# EAGLE design display (EAGLE 7.4.0)
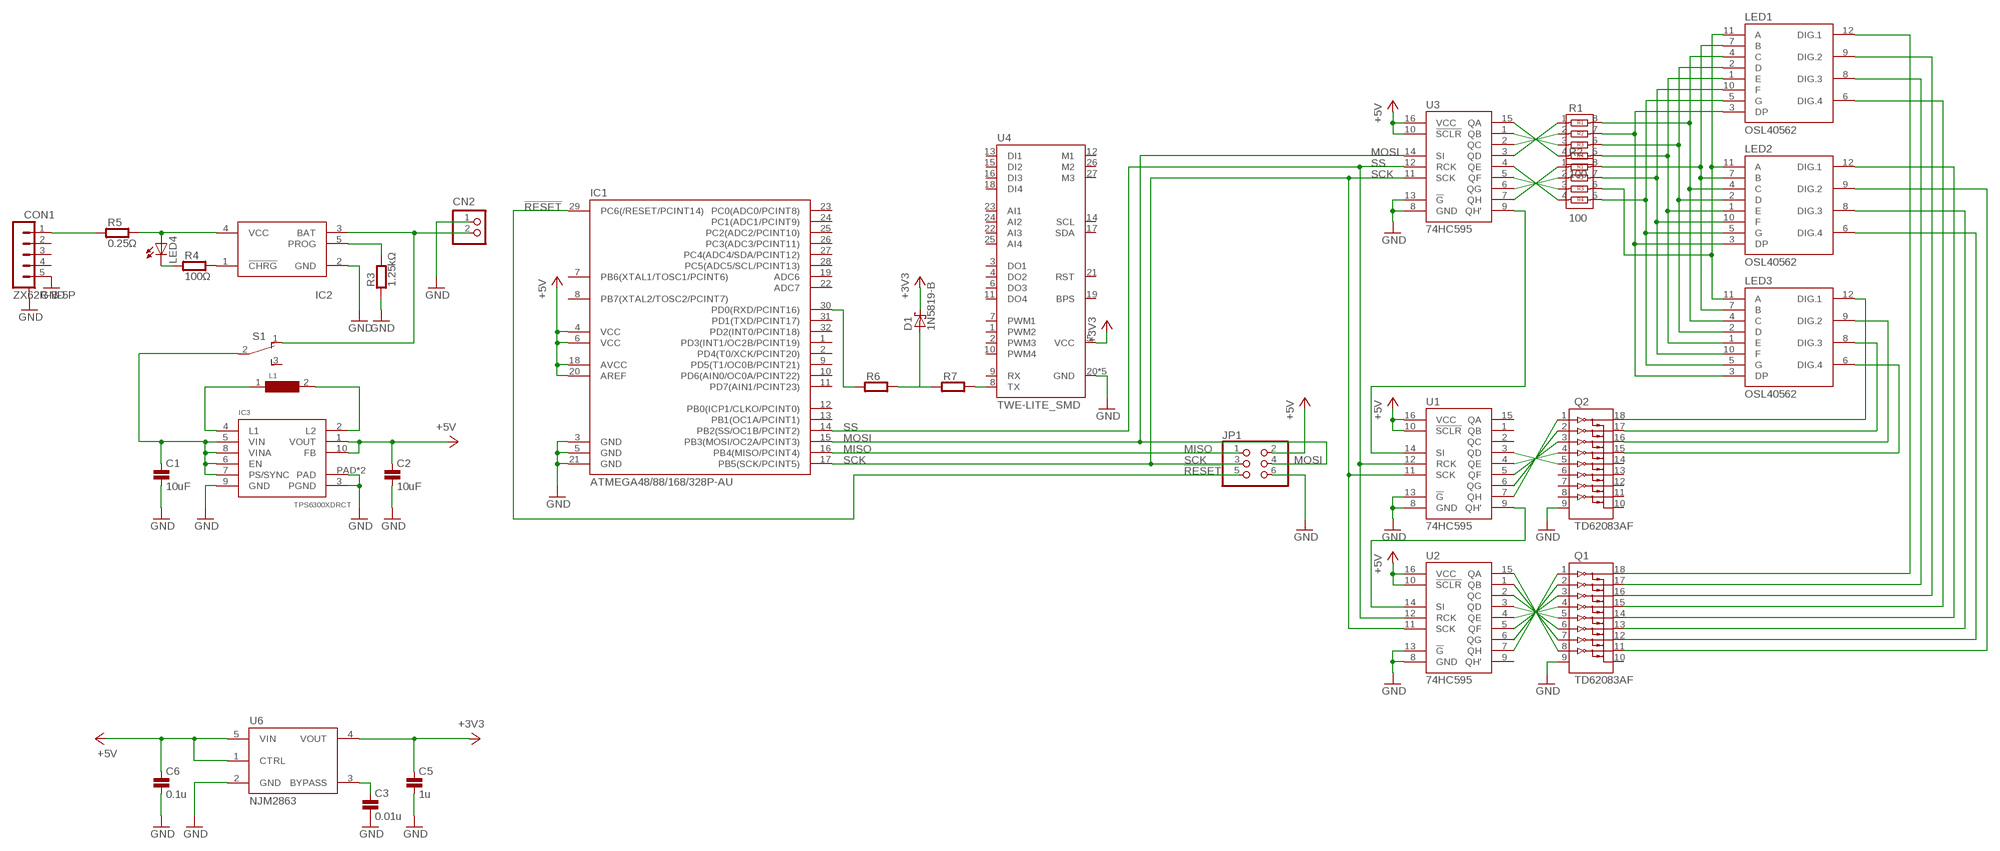
[diagram p0: schematic, sheet 1]

## Parts
C1  10uF  C0603  [0603@1]
C2  10uF  C0603  [0603@1]
C3  0.01u  C0603  [0603@1]
C5  1u  C0603  [0603@1]
C6  0.1u  C0603  [0603@1]
CN2  S2B-PH-K-S  [S2B-PH-K-S]
CON1  ZX62R-B-5P  [MICRO-B]
D1  1N5819-B  [DO41-7.6]
IC1  ATMEGA48/88/168/328P-AU  [TQFP32]
IC2  LTC4054  [TSOT23-5]
IC3  TPS6300XDRCT  [S-PVSON-N10]
JP1  PINHD-2X3  [2X03]
L1  VLF4012ST  [VLF4012ST]
LED1  OSL40562  [7SEG_4DIG]
LED2  OSL40562  [7SEG_4DIG]
LED3  OSL40562  [7SEG_4DIG]
LED4  LEDSML0603  [SML0603]
Q1  TD62083AF  [SOP18]
Q2  TD62083AF  [SOP18]
R1  100  BCN164AB  [BCN164AB]
R2  100  BCN164AB  [BCN164AB]
R3  1.25kΩ  R0603  [0603]
R4  100Ω  R0603  [0603]
R5  0.25Ω  R0603  [0603]
R6  R0204/5  [0204/5]
R7  R0204/5  [0204/5]
S1  SS-12D00  [SS-12D00]
U1  74HC595  [SOP16]
U2  74HC595  [SOP16]
U3  74HC595  [SOP16]
U4  TWE-LITE_SMD  [LITE]
U6  NJM2863  [SOT23_5PIN]

## Nets
!RESET!: IC1.29(PC6(/RESET/PCINT14)) JP1.5
+3V2: C1.1 IC3.5(VIN) IC3.6(EN) IC3.7(PS/SYNC) IC3.8(VINA) S1.2(P)
+3V3: C5.1 D1.C U4.5(VCC) U6.4(VOUT)
+5V: C2.1 C6.1 IC1.4(VCC) IC1.6(VCC) IC1.18(AVCC) IC1.20(AREF) IC3.1(VOUT) IC3.10(FB) JP1.2 U1.10(!SCLR!) U1.16(VCC) U2.10(!SCLR!) U2.16(VCC) U3.10(!SCLR!) U3.16(VCC) U6.1(CTRL) U6.5(VIN)
GND: C1.2 C2.2 C3.2 C5.2 C6.2 CN2.1 CON1.5(5.GND) CON1.CASE@1 CON1.CASE@2 CON1.CASE@3 CON1.CASE@4 IC1.3(GND) IC1.5(GND) IC1.21(GND) IC2.2(GND) IC3.3(PGND) IC3.9(GND) IC3.PAD IC3.PAD@1(PAD) JP1.6 Q1.9(GND) Q2.9(GND) R3.1 U1.8(GND) U1.13(!G!) U2.8(GND) U2.13(!G!) U3.8(GND) U3.13(!G!) U4.20(GND) U4.28(GND) U4.30(GND) U4.31(GND) U4.32(GND) U6.2(GND)
MISO: IC1.16(PB4(MISO/PCINT4)) JP1.1
MOSI: IC1.15(PB3(MOSI/OC2A/PCINT3)) JP1.4 U3.14(SI)
N$1: LED1.11(A) LED2.11(A) LED3.11(A) R2.6
N$2: LED1.7(B) LED2.7(B) LED3.7(B) R2.8
N$3: LED1.4(C) LED2.4(C) LED3.4(C) R1.8
N$4: LED1.2(D) LED2.2(D) LED3.2(D) R1.6
N$5: LED1.1(E) LED2.1(E) LED3.1(E) R1.5
N$6: LED1.10(F) LED2.10(F) LED3.10(F) R2.7
N$7: LED1.5(G) LED2.5(G) LED3.5(G) R2.5
N$8: LED1.3(DP) LED2.3(DP) LED3.3(DP) R1.7
N$9: CN2.2 IC2.3(BAT) S1.1(O)
N$10: C3.1 U6.3(BYPASS)
N$12: Q2.5(I5) U1.3(QD)
N$13: Q2.4(I4) U1.4(QE)
N$14: Q2.3(I3) U1.5(QF)
N$15: Q2.2(I2) U1.6(QG)
N$16: Q2.1(I1) U1.7(QH)
N$17: LED2.9(DIG.2) Q1.11(O8)
N$18: LED2.8(DIG.3) Q1.13(O6)
N$19: LED2.6(DIG.4) Q1.12(O7)
N$20: LED2.12(DIG.1) Q1.14(O5)
N$21: LED1.6(DIG.4) Q1.15(O4)
N$22: LED1.12(DIG.1) Q1.18(O1)
N$23: LED1.8(DIG.3) Q1.17(O2)
N$24: LED1.9(DIG.2) Q1.16(O3)
N$25: LED3.12(DIG.1) Q2.18(O1)
N$26: LED3.9(DIG.2) Q2.16(O3)
N$27: LED3.8(DIG.3) Q2.17(O2)
N$28: LED3.6(DIG.4) Q2.15(O4)
N$29: Q1.8(I8) U2.15(QA)
N$30: Q1.7(I7) U2.1(QB)
N$31: Q1.6(I6) U2.2(QC)
N$32: Q1.5(I5) U2.3(QD)
N$33: Q1.4(I4) U2.4(QE)
N$34: Q1.3(I3) U2.5(QF)
N$35: Q1.2(I2) U2.6(QG)
N$36: Q1.1(I1) U2.7(QH)
N$37: U1.9(QH') U2.14(SI)
N$38: R1.4 U3.15(QA)
N$39: R1.3 U3.1(QB)
N$40: R1.2 U3.2(QC)
N$41: R1.1 U3.3(QD)
N$42: R2.4 U3.4(QE)
N$43: R2.3 U3.5(QF)
N$44: R2.2 U3.6(QG)
N$45: R2.1 U3.7(QH)
N$46: U1.14(SI) U3.9(QH')
N$47: IC1.30(PD0(RXD/PCINT16)) R6.1
N$48: IC2.5(PROG) R3.2
N$49: IC2.4(VCC) LED4.A R5.2
N$50: IC2.1(!CHRG!) R4.2
N$51: LED4.C R4.1
N$52: IC3.4(L1) L1.1
N$53: IC3.2(L2) L1.2
N$57: D1.A R6.2 R7.1
N$58: R7.2 U4.8(TX)
N$59: CON1.1(1.VBUS) R5.1
SCK: IC1.17(PB5(SCK/PCINT5)) JP1.3 U1.11(SCK) U2.11(SCK) U3.11(SCK)
SS: IC1.14(PB2(SS/OC1B/PCINT2)) U1.12(RCK) U2.12(RCK) U3.12(RCK)
Unconnected: CON1.2(2.D-) CON1.3(3.D+) CON1.4(4.ID) IC1.1(PD3(INT1/OC2B/PCINT19)) IC1.2(PD4(T0/XCK/PCINT20)) IC1.7(PB6(XTAL1/TOSC1/PCINT6)) IC1.8(PB7(XTAL2/TOSC2/PCINT7)) IC1.9(PD5(T1/OC0B/PCINT21)) IC1.10(PD6(AIN0/OC0A/PCINT22)) IC1.11(PD7(AIN1/PCINT23)) IC1.12(PB0(ICP1/CLKO/PCINT0)) IC1.13(PB1(OC1A/PCINT1)) IC1.19(ADC6) IC1.22(ADC7) IC1.23(PC0(ADC0/PCINT8)) IC1.24(PC1(ADC1/PCINT9)) IC1.25(PC2(ADC2/PCINT10)) IC1.26(PC3(ADC3/PCINT11)) IC1.27(PC4(ADC4/SDA/PCINT12)) IC1.28(PC5(ADC5/SCL/PCINT13)) IC1.31(PD1(TXD/PCINT17)) IC1.32(PD2(INT0/PCINT18)) Q1.10(COMMON) Q2.6(I6) Q2.7(I7) Q2.8(I8) Q2.10(COMMON) Q2.11(O8) Q2.12(O7) Q2.13(O6) Q2.14(O5) S1.3(S) U1.1(QB) U1.2(QC) U1.15(QA) U2.9(QH') U4.1(PWM2) U4.2(PWM3) U4.3(DO1) U4.4(DO2) U4.6(DO3) U4.7(PWM1) U4.9(RX) U4.10(PWM4) U4.11(DO4) U4.12(M1) U4.13(DI1) U4.14(SCL) U4.15(DI2) U4.16(DI3) U4.17(SDA) U4.18(DI4) U4.19(BPS) U4.21(RST) U4.22(AI3) U4.23(AI1) U4.24(AI2) U4.25(AI4) U4.26(M2) U4.27(M3)

## Library data of the parts
C1-C3 C5 C6 = untitled:C: CAPACITOR
CN2 = jst-ph:S2B-PH-*: Wire-to-Board 2.0mm pitch side mount connector Source: http://www.jst-mfg.com/product/pdf/jpn/PH.pdf http://www.jst-mfg.com/product/detail.php?series=199
CON1 = untitled:ZX62R-B-5P
D1 = diode:1N581*: 1.0A SCHOTTKY BARRIER RECTIFIER Source: http://www.diodes.com/datasheets/ds23001.pdf
IC1 = ATmega328P:ATMEGA48/88/168/328P
IC2 = untitled:LTC4054
IC3 = untitled:TPS6300XDRCT
JP1 = pinhead:PINHD-2X3: PIN HEADER
L1 = untitled:VLF4012ST
LED1-LED3 = untitled:OSL40562
LED4 = led:LED: LED OSRAM: - CHIPLED LG R971, LG N971, LY N971, LG Q971, LY Q971, LO R971, LY R971 LH N974, LH R974 LS Q976, LO Q976, LY Q976 LO Q996 - Hyper CHIPLED LW Q18S LB Q993, LB Q99A, LB R99A - SideLED LS A670, LO A670, LY A670, LG A670, LP A670 LB A673, LV A673, LT A673, LW A673 LH A674 LY A675 LS A676, LA A676, LO A676, LY A676, LW A676 LS A679, LY A679, LG A679 - Hyper Micro SIDELED® LS Y876, LA Y876, LO Y876, LY Y876 LT Y87S - SmartLED LW L88C, LW L88S LB L89C, LB L89S, LG L890 LS L89K, LO L89K, LY L89K LS L896, LA L896, LO L896, LY L896 - TOPLED LS T670, LO T670, LY T670, LG T670, LP T670 LSG T670, LSP T670, LSY T670, LOP T670, LYG T670 LG T671, LOG T671, LSG T671 LB T673, LV T673, LT T673, LW T673 LH T674 LS T676, LA T676, LO T676, LY T676, LB T676, LH T676, LSB T676, LW T676 LB T67C, LV T67C, LT T67C, LS T67K, LO T67K, LY T67K, LW E67C LS E67B, LA E67B, LO E67B, LY E67B, LB E67C, LV E67C, LT E67C LW T67C LS T679, LY T679, LG T679 LS T770, LO T770, LY T770, LG T770, LP T770 LB T773, LV T773, LT T773, LW T773 LH T774 LS E675, LA E675, LY E675, LS T675 LS T776, LA T776, LO T776, LY T776, LB T776 LHGB T686 LT T68C, LB T68C - Hyper Mini TOPLED® LB M676 - Mini TOPLED Santana® LG M470 LS M47K, LO M47K, LY M47K Source: http://www.osram.convergy.de LUXEON: - LUMILED® LXK2-PW12-R00, LXK2-PW12-S00, LXK2-PW14-U00, LXK2-PW14-V00 LXK2-PM12-R00, LXK2-PM12-S00, LXK2-PM14-U00 LXK2-PE12-Q00, LXK2-PE12-R00, LXK2-PE12-S00, LXK2-PE14-T00, LXK2-PE14-U00 LXK2-PB12-K00, LXK2-PB12-L00, LXK2-PB12-M00, LXK2-PB14-N00, LXK2-PB14-P00, LXK2-PB14-Q00 LXK2-PR12-L00, LXK2-PR12-M00, LXK2-PR14-Q00, LXK2-PR14-R00 LXK2-PD12-Q00, LXK2-PD12-R00, LXK2-PD12-S00 LXK2-PH12-R00, LXK2-PH12-S00 LXK2-PL12-P00, LXK2-PL12-Q00, LXK2-PL12-R00 Source: www.luxeon.com KINGBRIGHT: KA-3528ASYC Source: www.kingbright.com
Q1 Q2 = untitled:TD62083A
R1 R2 = untitled:BCN164AB
R3-R7 = untitled:R: RESISTOR
S1 = switch-slide:SS-12D00: SLIDE SWITCH
U1-U3 = untitled:74HC595
U4 = untitled:TWE-LITE
U6 = untitled:NJM2863

## Board
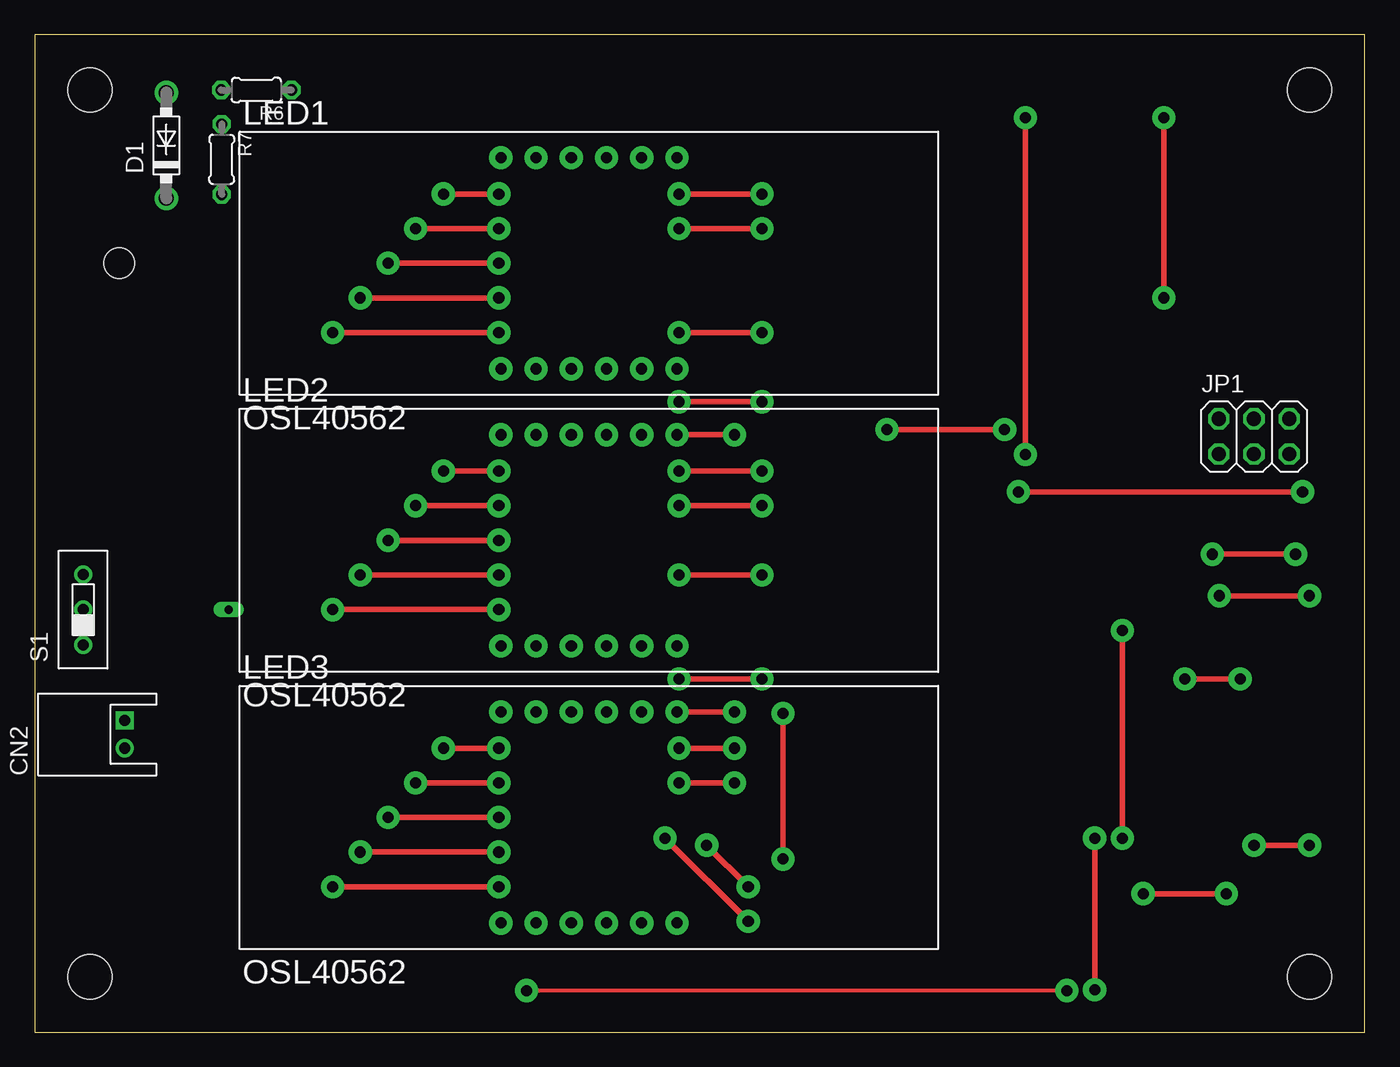
[diagram p1: board, top side]
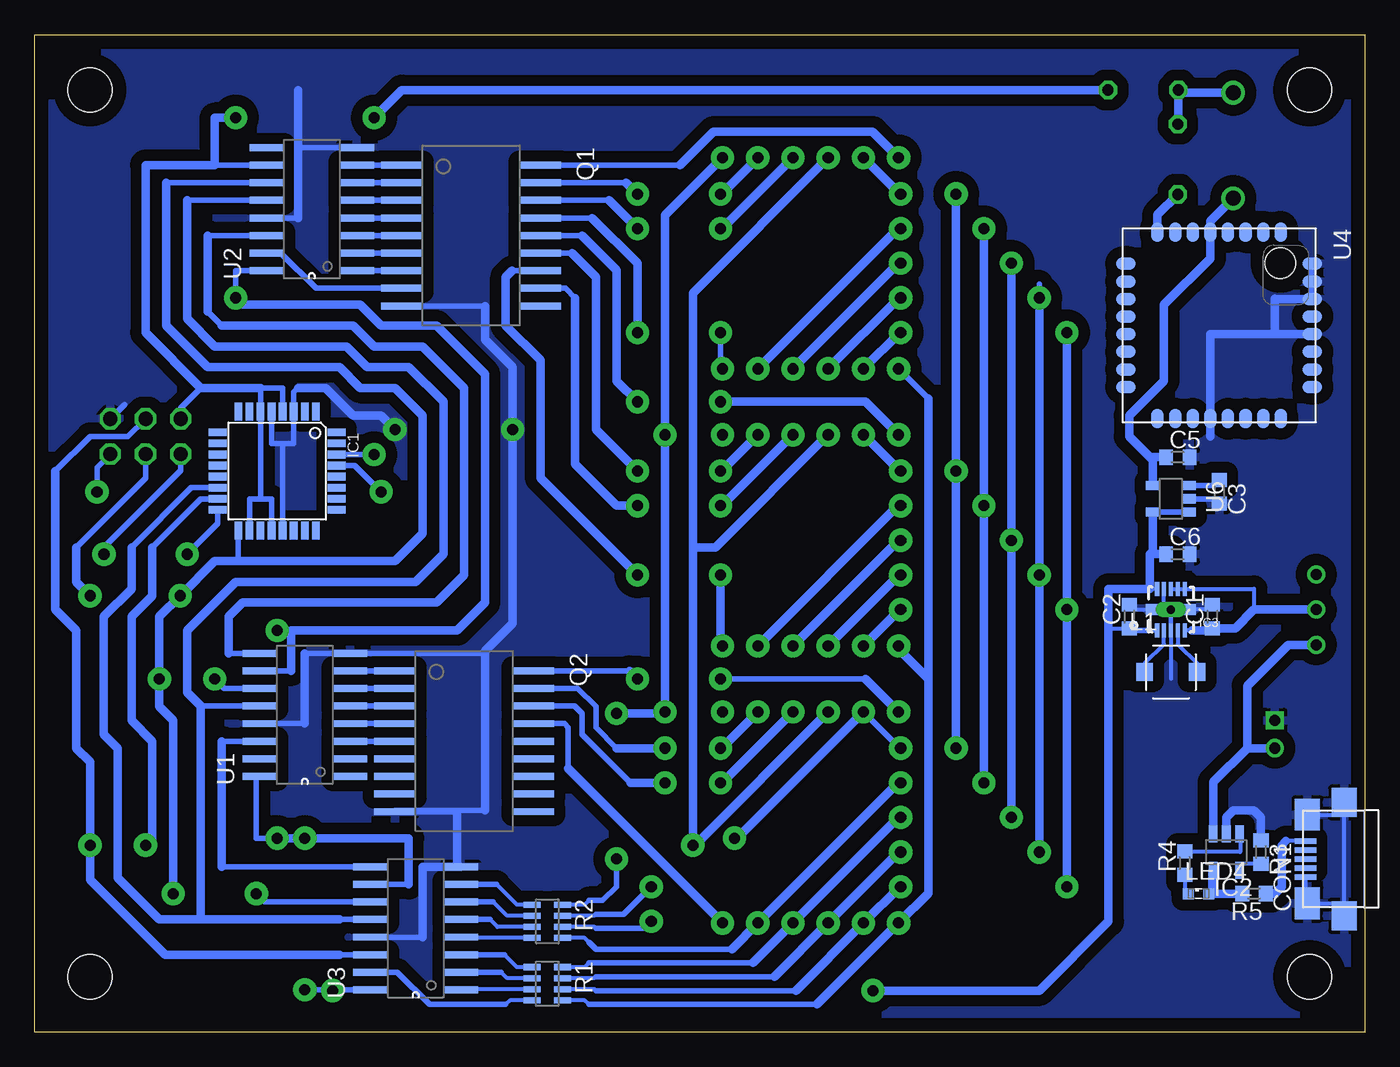
[diagram p2: board, bottom side, seen from below]

Size 96 x 72 mm. Coordinates in mm from the lower left corner, seen from the top.
Outline: 0,0 96,0 96,72 0,72 0,0
Copper layers (1*16): Top 0.035mm / dielectric 1.5mm / Bottom 0.035mm
Design rules "default *": minimum track width 10mil, minimum drill 24mil, track to track 8mil, track to pad 8mil, pad to pad 8mil, via to via 8mil, smd to smd 8mil, copper to edge 40mil, drill to drill 8mil, minimum pad ring 10mil, minimum via ring 8mil, stop-mask expansion 4mil, vias tented up to drill 0mil, thermal gap 10mil
Holes 2.2 mm at 6.1,55.5
Holes 3.2 mm at 4,68 92,68 4,4 92,4

### Footprints (pad centres in the part's own frame; a part is rotated, then mirrored left to right if it is on the bottom)
0603@1 = smd 1 x 1.1: 1 -0.85,0; 2 0.85,0
S2B-PH-K-S = drill 0.8 square: 1 1,0 | drill 0.8: 2 -1,0
MICRO-B = smd 0.4 x 1.55: 1 1.3,2.775; 2 0.65,2.775; 3 0,2.775; 4 -0.65,2.775; 5 -1.3,2.775 | smd 2.3 x 1.8: CASE@1 -3.2,2.65; CASE@2 3.2,2.65 | smd 2.1 x 1.8: CASE@3 -4.1,0; CASE@4 4.075,0
DO41-7.6 = drill 1.1 pad 1.7: A 3.81,0; C -3.81,0
TQFP32 = smd 1.27 x 0.559: 1 -4.293,2.8; 2 -4.293,2; 3 -4.293,1.2; 4 -4.293,0.4; 5 -4.293,-0.4; 6 -4.293,-1.2; 7 -4.293,-2; 8 -4.293,-2.8; 17 4.293,-2.8; 18 4.293,-2; 19 4.293,-1.2; 20 4.293,-0.4; 21 4.293,0.4; 22 4.293,1.2; 23 4.293,2; 24 4.293,2.8 | smd 0.559 x 1.27: 9 -2.8,-4.293; 10 -2,-4.293; 11 -1.2,-4.293; 12 -0.4,-4.293; 13 0.4,-4.293; 14 1.2,-4.293; 15 2,-4.293; 16 2.8,-4.293; 25 2.8,4.293; 26 2,4.293; 27 1.2,4.293; 28 0.4,4.293; 29 -0.4,4.293; 30 -1.2,4.293; 31 -2,4.293; 32 -2.8,4.293
TSOT23-5 = smd 0.62 x 1.22: 1 -0.95,-1.31; 2 0,-1.31; 3 0.95,-1.31; 4 0.95,1.31; 5 -0.95,1.31
S-PVSON-N10 = smd 0.3 x 1: 1 -1,-1.5; 2 -0.5,-1.5; 3 0,-1.5; 4 0.5,-1.5; 5 1,-1.5; 6 1,1.5; 7 0.5,1.5; 8 0,1.5; 9 -0.5,1.5; 10 -1,1.5 | smd 3.6 x 0.8: PAD 0,0 | drill 0.6 long: PAD@1 0,0
2X03 = drill 1.016 octagon: 1 -2.54,-1.27; 2 -2.54,1.27; 3 0,-1.27; 4 0,1.27; 5 2.54,-1.27; 6 2.54,1.27
VLF4012ST = smd 1.2 x 1.3: 1 1.9,0; 2 -1.9,0
7SEG_4DIG = drill 0.8 pad 1.676: 1 -6.35,-7.62; 2 -3.81,-7.62; 3 -1.27,-7.62; 4 1.27,-7.62; 5 3.81,-7.62; 6 6.35,-7.62; 7 6.35,7.62; 8 3.81,7.62; 9 1.27,7.62; 10 -1.27,7.62; 11 -3.81,7.62; 12 -6.35,7.62
SML0603 = smd 0.8 x 0.8: A 0.75,0; C -0.75,0
SOP18 = smd 0.5 x 3: 1 -5.08,-5; 2 -3.81,-5; 3 -2.54,-5; 4 -1.27,-5; 5 0,-5; 6 1.27,-5; 7 2.54,-5; 8 3.81,-5; 9 5.08,-5; 10 5.08,5; 11 3.81,5; 12 2.54,5; 13 1.27,5; 14 0,5; 15 -1.27,5; 16 -2.54,5; 17 -3.81,5; 18 -5.08,5
BCN164AB = smd 0.44 x 1.2: 1 -1.2,-1.1; 2 -0.4,-1.1; 3 0.4,-1.1; 4 1.2,-1.1; 5 1.2,1.1; 6 0.4,1.1; 7 -0.4,1.1; 8 -1.2,1.1
0603 = smd 1 x 1.1: 1 -0.85,0; 2 0.85,0
0204/5 = drill 0.813 octagon: 1 -2.54,0; 2 2.54,0
SS-12D00 = drill 0.8: 1 -2.54,0; 2 0,0; 3 2.54,0
SOP16 = smd 0.5 x 2.5: 1 -4.445,-3.25; 2 -3.175,-3.25; 3 -1.905,-3.25; 4 -0.635,-3.25; 5 0.635,-3.25; 6 1.905,-3.25; 7 3.175,-3.25; 8 4.445,-3.25; 9 4.445,3.25; 10 3.175,3.25; 11 1.905,3.25; 12 0.635,3.25; 13 -0.635,3.25; 14 -1.905,3.25; 15 -3.175,3.25; 16 -4.445,3.25
LITE = smd 1.4 x 0.9: 1 0.25,11.43; 2 0.25,10.16; 3 0.25,8.89; 4 0.25,7.62; 5 0.25,6.35; 6 0.25,5.08; 7 0.25,3.81; 8 0.25,2.54; 17 13.72,2.54; 18 13.72,3.81; 19 13.72,5.08; 20 13.72,6.35; 21 13.72,7.62; 22 13.72,8.89; 23 13.72,10.16; 24 13.72,11.43 | smd 0.9 x 1.4: 9 2.54,0.25; 10 3.81,0.25; 11 5.08,0.25; 12 6.35,0.25; 13 7.62,0.25; 14 8.89,0.25; 15 10.16,0.25; 16 11.43,0.25; 25 11.43,13.72; 26 10.16,13.72; 27 8.89,13.72; 28 7.62,13.72; 29 6.35,13.72; 30 5.08,13.72; 31 3.81,13.72; 32 2.54,13.72
SOT23_5PIN = smd 0.66 x 1: 1 0.95,1.3; 2 0,1.3; 3 -0.95,1.3; 4 -0.95,-1.3; 5 0.95,-1.3

### Placement (x,y rotation side)
C1  11,30 90 bottom
C2  17,30 90 bottom
C3  10.5,39 270 bottom
C5  13.5,41.5 0 bottom
C6  13.5,34.5 0 bottom
CN2  6.5,21.5 90 top
CON1  1.5,12.5 90 bottom
D1  9.5,64 90 top
IC1  78.5,40.5 270 bottom
IC2  10,13 180 bottom
IC3  14,30.5 0 bottom
JP1  88,43 0 top
L1  14,26 0 bottom
LED1  40,55.5 0 top
LED2  40,35.5 0 top
LED3  40,15.5 0 top
LED4  12,10 0 bottom
Q1  64.5,57.5 270 bottom
Q2  65,21 270 bottom
R1  59,3.5 270 bottom
R2  59,8 270 bottom
R3  7.5,13 270 bottom
R4  13,12.2 90 bottom
R5  8,10 180 bottom
R6  16,68 180 top
R7  13.5,63 270 top
S1  3.5,30.5 90 top
U1  76.5,22.91 90 bottom
U2  76,59.41 90 bottom
U3  68.5,7.5 90 bottom
U4  17.5,58 270 bottom
U6  14,38.5 270 bottom

### Tracks (layer width: path | path; a pad name or v marks a point on that pad's centre or on a via)
!RESET!  (via drill 0.8 pad 1.68)
  Top 0.406: v71,39 v91.5,39
  Bottom 0.406: IC1.29 72.9,40.9 v71,39 | JP1.5 91.5,40.77 v91.5,39
+3V2
  Bottom 0.305: 12.5,29 IC3.5 | IC3.8 IC3.7 IC3.6 8,32 8,30.5
  Bottom 0.61: S1.2 8,30.5 9.35,29.15 C1.1 11.15,29 12.5,29
+3V3
  Bottom 0.61: D1.C 11.15,58.54 U4.5 11.15,55.85 14.5,52.5 14.5,47 17,44.5 17,43 15.5,41.5 | 15.5,41.5 C5.1 | 15.5,41.5 15.3,41.3 U6.4
+5V  (via drill 0.8 pad 1.68)
  Top 0.305: v74.5,3 v35.5,3
  Top 0.406: v76.5,14 v76.5,3.06 | v78.5,29 v78.5,14 | v81.5,53 v81.5,66
  Bottom 0.305: 17,29 C2.1 18.5,29.15 | 15.5,29 IC3.1 | IC3.10 15.5,32 | 75.5,3.06 74.5,3.06 v74.5,3
  Bottom 0.406: U3.10 69,10.68 | U3.16 75.5,3.06 v76.5,3.06 | U1.16 80,18.46 80,14 v78.5,14 | U1.10 77.5,26.08 | 77.5,29 v78.5,29 | 81,52.5 v81.5,53 81.5,54.96 U2.16 | 83,62.58 U2.10 | IC1.4 78.1,46.5 79.7,46.5 IC1.6 79.7,38.5 | IC1.20 78.9,38.5 79.7,38.5 | 79.7,38.5 80.5,38.5 IC1.18 | 84,46.5 85.46,45.04 JP1.2 | 17,29 15.5,29 | U6.1 U6.5
  Bottom 0.61: 69,10.68 69,14 v76.5,14 v78.5,14 | 77.5,26.08 77.5,29 65.5,29 63.5,31 63.5,47.5 67,51 71,51 72.5,52.5 81,52.5 | v81.5,66 83,66 83,62.58 88,62.58 88,50.5 84,46.5 79.7,46.5 | v35.5,3 23.5,3 18.5,8 18.5,29.15 18.5,32 15.5,32 15.5,34.5 | C6.1 15.3,34.5 | 15.5,34.5 15.3,34.7 | U6.5 15.3,34.5 | 15.3,34.5 15.5,34.5
GND  (via drill 0.8 pad 1.68)
  Top 0.406: v70,43.5 v61.5,43.5
  Bottom 0.305: CON1.CASE@3 1.5,9.3 | 1.5,9.3 CON1.CASE@4 1.5,15.7 CON1.CASE@2 | 1.5,9.3 CON1.CASE@1 4.28,9.3 CON1.5 | IC3.3 IC3.PAD@1 | C2.2 17,30.5 IC3.PAD@1 | IC3.PAD@1 14.5,30.5 IC3.9 | IC3.PAD@1 11,30.5 C1.2 11.35,30.5 IC3.PAD@1 | IC2.2 10,15.5 | IC3.PAD@1 14,25.5
  Bottom 0.406: 68,6.87 U3.13 | U3.8 65.25,12 65.5,12 | 65.5,15.92 Q2.9 70,16 63.5,16 | 63.5,27.35 U1.8 76.5,27.35 | 76.5,22.27 U1.13 | U2.8 77,63.85 | 77,58.77 U2.13 | Q1.9 63.5,52.42 | 78.1,42.5 77.3,42.5 IC1.3 77.3,46.2 77,46.5 | 78.1,42.5 78.9,42.5 IC1.5 | IC1.21 78.1,42.5 | JP1.6 89.5,45.31 | C3.2 10.85,38.5 U6.2
  Bottom 0.61: U3.8 68,11.95 68,6.87 | 65.5,12 65.5,15.92 | 63.5,16 63.5,27.35 63.5,27.5 61.5,29.5 v61.5,43.5 61.5,48 63.5,50 63.5,52.42 | 76.5,27.35 76.5,22.27 | 77,58.77 77,63.85 77,68 | 77,46.5 75,46.5 73,44.5 71,44.5 v70,43.5 | U4.28 6.5,50.38 | 6.5,50.38 11.15,50.38 U4.20 11.15,43 | 6.5,52.92 6.5,50.38 | U4.31 U4.32 U4.30 6.5,52.92 | 6.5,52.92 6.5,52.96 | R3.1 7.5,15.5 8,16 9.5,16 10,15.5 10,14 | 4.15,15.5 CON1.CASE@2
  pour Bottom (isolate 0.813): 0,72 96,72 96,0 0,0
MISO  (via drill 0.8 pad 1.68)
  Top 0.406: v85,34.5 v91,34.5
  Bottom 0.406: IC1.16 82.79,36.71 v85,34.5 | JP1.1 85.46,40.54 91,35 v91,34.5
MOSI  (via drill 0.8 pad 1.68)
  Top 0.406: v92,13.5 v88,13.5
  Bottom 0.406: IC1.15 84,38.5 87.5,35 | JP1.4 89.27,43 92,43 94.5,40.5 | U3.14 74,5.59
  Bottom 0.61: v88,13.5 87.5,14 87.5,21 89,22.5 89,30 87.5,31.5 87.5,35 | 74,5.59 86.59,5.59 92,11 v92,13.5 92,19.5 93,20.5 93,29 94.5,30.5 94.5,40.5
N$1  (via drill 0.8 pad 1.68)
  Top 0.406: v33.5,20.5 v29.5,20.5 | v33.5,40.5 v29.5,40.5 | v33.5,60.5 v29.5,60.5 | v45.5,14 v51.5,8
  Bottom 0.305: 55.5,7.5 55.6,7.6 R2.6
  Bottom 0.406: LED3.11 33.57,20.5 v33.5,20.5 | 33.57,40.5 v33.5,40.5 | 33.57,60.5 v33.5,60.5 | 45.31,14 v45.5,14 | v51.5,8 52,7.5 55.5,7.5
  Bottom 0.61: v29.5,20.5 v29.5,40.5 v29.5,60.5 | LED2.11 33.57,40.5 | LED1.11 33.57,60.5 | LED3.11 45.31,14
N$2  (via drill 0.8 pad 1.68)
  Top 0.406: LED3.7 v50.5,23.12 | LED2.7 v50.5,43.12 | v54,23 v54,12.5
  Bottom 0.305: 56,9.5 56.3,9.2 R2.8
  Bottom 0.406: v50.5,23.12 50.62,23 | v54,12.5 54,10.5 55,9.5 56,9.5
  Bottom 0.61: LED1.7 50.5,58.97 v50.5,43.12 v50.5,23.12 | 50.62,23 v54,23
N$3  (via drill 0.8 pad 1.68)
  Top 0.406: v33.5,15.5 v25.5,15.5 | v33.5,35.5 v25.5,35.5 | v33.5,55.5 v25.5,55.5
  Bottom 0.305: 56,5 56.3,4.7 R1.8
  Bottom 0.406: 33.65,15.5 v33.5,15.5 | 33.65,35.5 v33.5,35.5 | 33.65,55.5 v33.5,55.5 | 44.15,5 56,5
  Bottom 0.61: 33.65,15.5 LED3.4 44.15,5 | v25.5,15.5 v25.5,35.5 v25.5,55.5 | LED2.4 33.65,35.5 | LED1.4 33.65,55.5
N$4  (via drill 0.8 pad 1.68)
  Top 0.406: v33.5,10.5 v21.5,10.5 | v33.5,30.5 v21.5,30.5 | v33.5,50.5 v21.5,50.5
  Bottom 0.305: 55.5,3 55.6,3.1 R1.6
  Bottom 0.406: 33.57,10.5 v33.5,10.5 | 33.57,30.5 v33.5,30.5 | 33.57,50.5 v33.5,50.5 | 41.07,3 55.5,3
  Bottom 0.61: 33.57,10.5 LED3.2 41.07,3 | v21.5,10.5 v21.5,30.5 v21.5,50.5 | LED2.2 33.57,30.5 | LED1.2 33.57,50.5
N$5
  Bottom 0.305: 56,2 56.3,2.3 R1.5
  Bottom 0.406: 33.65,27.65 LED2.1 | LED1.1 31.5,45.73 | 39.53,2 56,2
  Bottom 0.61: 31.5,25.5 31.5,10.03 LED3.1 39.53,2 | 31.5,25.5 33.65,27.65 | 31.5,45.73 31.5,25.5
N$6  (via drill 0.8 pad 1.68)
  Top 0.406: v48.5,13.5 v51.5,10.5
  Bottom 0.305: 55.5,8.5 55.6,8.4 R2.7
  Bottom 0.406: 48.35,13.5 v48.5,13.5 | v51.5,10.5 53.5,8.5 55.5,8.5
  Bottom 0.61: LED1.10 48.5,53.35 48.5,35 | 48.5,35 v48.5,13.5 | LED3.10 48.35,13.5 | LED2.10 46.85,35 48.5,35
N$7  (via drill 0.8 pad 1.68)
  Top 0.406: v33.5,18 v27.5,18 | v33.5,38 v27.5,38 | v33.5,58 v27.5,58
  Bottom 0.305: 56,6.5 56.3,6.8 R2.5
  Bottom 0.406: 33.69,18 v33.5,18 | 33.69,38 v33.5,38 | 33.69,58 v33.5,58 | 45.69,6 55.5,6 56,6.5
  Bottom 0.61: 33.69,18 LED3.5 45.69,6 | v27.5,18 v27.5,38 v27.5,58 | LED2.5 33.69,38 | LED1.5 33.69,58
N$8  (via drill 0.8 pad 1.68)
  Top 0.406: v33.5,13 v23.5,13 | v33.5,33 v23.5,33 | v33.5,53 v23.5,53
  Bottom 0.305: 55.5,4 55.6,3.9 R1.7
  Bottom 0.406: 33.61,13 v33.5,13 | v23.5,53 23.5,54 | 33.61,33 v33.5,33 | 33.61,53 v33.5,53 | 42.61,4 55.5,4
  Bottom 0.61: 33.61,13 LED3.3 42.61,4 | v23.5,13 v23.5,33 v23.5,53 | LED2.3 33.61,33 | LED1.3 33.61,53
N$9
  Bottom 0.61: S1.1 5.54,27.96 8.5,25 8.5,20.5 | 8.5,20.5 CN2.2 | IC2.3 10.95,18.05 8.5,20.5
N$10
  Bottom 0.406: C3.1 10.9,39.45 U6.3
N$12
  Bottom 0.406: Q2.5 U1.3
N$13
  Bottom 0.406: Q2.4 U1.4
N$14
  Bottom 0.406: Q2.3 U1.5
N$15
  Bottom 0.406: Q2.2 U1.6
N$16
  Bottom 0.406: Q2.1 U1.7
N$17  (via drill 0.8 pad 1.68)
  Top 0.406: v46.5,38 v52.5,38
  Bottom 0.406: 46.39,38 v46.5,38 | Q1.11 57.69,53.69 57,53
  Bottom 0.61: LED2.9 46.39,38 | v52.5,38 54,38 57,41 57,53
N$18  (via drill 0.8 pad 1.68)
  Top 0.406: v46.5,40.5 v52.5,40.5
  Bottom 0.406: 46.43,40.5 v46.5,40.5 | 57.23,56.23 Q1.13
  Bottom 0.61: LED2.8 46.43,40.5 | v52.5,40.5 55.5,43.5 55.5,54.5 57.23,56.23
N$19  (via drill 0.8 pad 1.68)
  Top 0.406: v46.5,33 v52.5,33
  Bottom 0.406: LED2.6 46.5,28.03 | 61.54,54.96 Q1.12
  Bottom 0.61: 46.5,28.03 v46.5,33 | v52.5,33 59.5,40 59.5,48.5 62,51 62,54.5 61.54,54.96
N$20  (via drill 0.8 pad 1.68)
  Top 0.406: v46.5,45.5 v52.5,45.5
  Bottom 0.406: 56.5,57.5 Q1.14
  Bottom 0.61: LED2.12 36.03,45.5 v46.5,45.5 | v52.5,45.5 54,47 54,55 56.5,57.5
N$21  (via drill 0.8 pad 1.68)
  Top 0.406: v46.5,50.5 v52.5,50.5
  Bottom 0.406: LED1.6 46.5,48.03 v46.5,50.5 | 55.77,58.77 Q1.15
  Bottom 0.61: v52.5,50.5 52.5,55.5 55.77,58.77
N$22
  Bottom 0.406: 49.42,62.58 Q1.18
  Bottom 0.61: LED1.12 35.53,65 47,65 49.42,62.58
N$23  (via drill 0.8 pad 1.68)
  Top 0.406: v46.5,60.5 v52.5,60.5
  Bottom 0.406: 46.43,60.5 v46.5,60.5 | 53.31,61.31 Q1.17
  Bottom 0.61: LED1.8 46.43,60.5 | v52.5,60.5 53.31,61.31
N$24  (via drill 0.8 pad 1.68)
  Top 0.406: v46.5,58 v52.5,58
  Bottom 0.406: 46.39,58 v46.5,58 | 54.54,60.04 Q1.16
  Bottom 0.61: LED1.9 46.39,58 | v52.5,58 54.54,60.04
N$25  (via drill 0.8 pad 1.68)
  Top 0.406: v46.5,25.5 v52.5,25.5
  Bottom 0.406: 36.03,25.5 v46.5,25.5 | 53.08,26.08 Q2.18
  Bottom 0.61: LED3.12 36.03,25.5 | v52.5,25.5 53.08,26.08
N$26  (via drill 0.8 pad 1.68)
  Top 0.406: v46.5,18 v50.5,18
  Bottom 0.406: 46.39,18 v46.5,18 | 53,18 56.5,21.5 56.5,23 57.04,23.54 Q2.16
  Bottom 0.61: LED3.9 46.39,18 | v50.5,18 53,18
N$27  (via drill 0.8 pad 1.68)
  Top 0.406: v46.5,20.5 v50.5,20.5
  Bottom 0.406: 46.43,20.5 v46.5,20.5 | 54,20.5 55.5,22 55.5,23.5 56.81,24.81 Q2.17
  Bottom 0.61: LED3.8 46.43,20.5 | v50.5,20.5 54,20.5
N$28
  Bottom 0.406: Q2.15 57.77,22.27 57.5,22 57.5,19.03
  Bottom 0.61: LED3.6 57.5,19.03
N$29
  Bottom 0.406: Q1.8 75.69,53.69 78.23,56.23 U2.15
N$30
  Bottom 0.406: Q1.7 U2.1
N$31
  Bottom 0.406: Q1.6 U2.2
N$32
  Bottom 0.406: Q1.5 U2.3
N$33
  Bottom 0.406: Q1.4 U2.4
N$34
  Bottom 0.406: Q1.3 U2.5
N$35
  Bottom 0.406: Q1.2 U2.6
N$36
  Bottom 0.406: Q1.1 U2.7
N$37
  Bottom 0.406: U1.9 82,27.35 | 82.5,51 83.5,52 | 83.5,57.5 U2.14
  Bottom 0.61: 82,27.35 82,30 81,31 67,31 65,33 65,46.5 68,49.5 71.5,49.5 73,51 82.5,51 | 83.5,52 83.5,57.5
N$38
  Bottom 0.305: R1.4 61.7,2.3 62,2
  Bottom 0.406: 62,2 67.5,2 69.83,4.33 U3.15
N$39
  Bottom 0.305: R1.3 65.2,3.1 U3.1
N$40
  Bottom 0.305: R1.2 61.9,3.9 62.33,4.33
  Bottom 0.406: 62.33,4.33 U3.2
N$41
  Bottom 0.305: R1.1 61.2,4.7 62.09,5.59
  Bottom 0.406: 62.09,5.59 U3.3
N$42
  Bottom 0.305: R2.4 65.19,6.8 U3.4
N$43
  Bottom 0.305: R2.3 62.6,7.6 63.13,8.13
  Bottom 0.406: 63.13,8.13 U3.5
N$44
  Bottom 0.305: R2.2 61.9,8.4 62.91,9.4
  Bottom 0.406: 62.91,9.4 U3.6
N$45
  Bottom 0.305: R2.1 61.2,9.2 62.67,10.68
  Bottom 0.406: 62.67,10.68 U3.7
N$46
  Bottom 0.406: U3.9 82.5,11.95 | 82.5,21 U1.14
  Bottom 0.61: 82.5,11.95 82.5,21
N$47  (via drill 0.8 pad 1.68)
  Top 0.406: v71.5,41.7 v71.5,66
  Bottom 0.406: IC1.30 v71.5,41.7
  Bottom 0.61: v71.5,66 69.5,68 R6.1
N$48
  Bottom 0.305: R3.2 9.05,12.15 IC2.5
N$49
  Bottom 0.305: 11,11.64 IC2.4
  Bottom 0.61: 11,11.64 11,10 | 11,10 LED4.A | 11,10 R5.2
N$50
  Bottom 0.305: IC2.1 9,14.26 9,13 12.95,13 R4.2
N$51
  Bottom 0.305: R4.1 13,10 LED4.C
N$52
  Bottom 0.305: IC3.4 13.5,28 12.1,26.6 L1.1
N$53
  Bottom 0.305: IC3.2 14.5,28 15.9,26.6 L1.2
N$57
  Bottom 0.61: D1.A 13.27,67.81 R6.2 13.46,65.58 R7.1
N$58
  Bottom 0.61: R7.2 14.96,59 U4.8
N$59
  Bottom 0.305: CON1.1 5.7,13.8
  Bottom 0.61: 5.7,13.8 6,13.5 6,10.5 6.5,10 R5.1
SCK  (via drill 0.8 pad 1.68)
  Top 0.406: v80,10 v86,10 | v83,25.5 v87,25.5 | v92,31.5 v85.5,31.5
  Bottom 0.406: U2.11 86.5,61.31 | U3.11 79.41,9.4 v80,10 | U1.11 82.31,24.81 v83,25.5 | IC1.17 81.3,34 81,34 | JP1.3 88,40 93,35
  Bottom 0.61: 86.5,61.31 86.5,51 83.5,48 74,48 72.5,46.5 70,46.5 68,44.5 68,36 70,34 81,34 83,34 v85.5,31.5 87,30 v87,25.5 87,23.5 86,22.5 v86,10 | 93,35 93,32.5 v92,31.5
SS
  Bottom 0.406: U1.12 84,23.54 | 74,8.13 U3.12 | 85,60.04 U2.12 | IC1.14 84.7,39.3 89,35
  Bottom 0.61: 84,8.13 84,23.54 85,24.54 85,29 81.5,32.5 68.5,32.5 66.5,34.5 66.5,45.5 69,48 72,48 73.5,49.5 83,49.5 85,51.5 85,60.04 | 84,8.13 74,8.13 | 84,8.13 87,8.13 90,11.13 90,20.5 91,21.5 91,30 89,32 89,35